# Altium schematic sheet 300_CDH_RS422.SchDoc: RS422 Line Driver
size A; DrawnBy: Tyler Sengia; Engineer: Tyler Sengia; Organization: PSU Student Space Projects Lab; Revision: 1
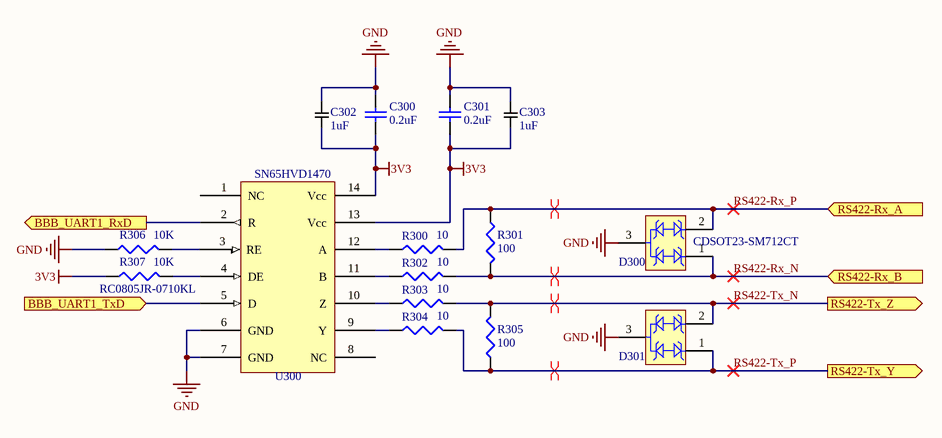
[diagram p0: 300_CDH_RS422.SchDoc]

## Parts
C300  value 0.2uF  [IMPERIAL0805_CAPACITOR]  (hidden comment: 0.2uF Capacitor)
C301  value 0.2uF  [IMPERIAL0805_CAPACITOR]  (hidden comment: 0.2uF Capacitor)
C302  value 1uF  [IMPERIAL0603_Capacitor]  (hidden comment: 1 uF Capacitor)
C303  value 1uF  [IMPERIAL0603_Capacitor]  (hidden comment: 1 uF Capacitor)
D300  Other Names: CDSOT23-SM712CT  [BOUR-SOT23-3_V]  (hidden comment: CDSOT23-SM712)
D301  CDSOT23-SM712  [BOUR-SOT23-3_V]  (value not drawn)
R300  value 10  [Imperial1206_RES]  (hidden comment: 10 Ohm Resistor)
R301  value 100  [Imperial0805_RES]  (hidden comment: 100 Ohm Resistor)
R302  value 10  [Imperial1206_RES]  (hidden comment: 10 Ohm Resistor)
R303  value 10  [Imperial1206_RES]  (hidden comment: 10 Ohm Resistor)
R304  value 10  [Imperial1206_RES]  (hidden comment: 10 Ohm Resistor)
R305  value 100  [Imperial0805_RES]  (hidden comment: 100 Ohm Resistor)
R306  value 10K  [Imperial0805_RES]  (hidden comment: RC0805JR-0710KL)
R307  RC0805JR-0710KL  value 10K  [Imperial0805_RES]
U300  Generic Part Number: SN65HVD1470  [SOIC127P590X175-14M]  (hidden comment: SN65HVD1470D)

## Ports
BBB_UART1_RxD (out), BBB_UART1_TxD (in), RS422-Rx_A (in), RS422-Rx_B (in), RS422-Tx_Y (out), RS422-Tx_Z (out)

## Nets
3V3: C300.1 C301.1 C302.1 C303.1 R307.1 U300.13(Vcc) U300.14(Vcc)
GND: C300.2 C301.2 C302.2 C303.2 D300.3 D301.3 R306.1 U300.6(GND) U300.7(GND)
BBB_UART1_RxD: U300.2(R) ; port BBB_UART1_RxD
BBB_UART1_TxD: U300.5(D) ; port BBB_UART1_TxD
RS422-Rx_N: D300.1 R301.2 R302.2 ; port RS422-Rx_B
RS422-Rx_P: D300.2 R300.2 R301.1 ; port RS422-Rx_A
RS422-Tx_N: D301.2 R303.2 R305.2 ; port RS422-Tx_Z
RS422-Tx_P: D301.1 R304.2 R305.1 ; port RS422-Tx_Y
NetR300_1: R300.1 U300.12(A)
NetR302_1: R302.1 U300.11(B)
NetR303_1: R303.1 U300.10(Z)
NetR304_1: R304.1 U300.9(Y)
NetR306_2: R306.2 U300.3(RE)
NetR307_2: R307.2 U300.4(DE)

Not connected (* = marked no-connect by the designer): U300 1(NC) 8(NC)

## Layout directives
differential pair; rule Impedance Constraint [Min = 90.00    Max = 110.0    ]: RS422-Rx_N, RS422-Rx_P, RS422-Tx_N, RS422-Tx_P

## Library data of the parts
C300 C301 = GCM219R71C204JA37J: Published: 8-Jun-2000; LatestRevisionDate: 29-May-2009; LatestRevisionNote: IPC-7351 Footprint Added.; PackageReference: C1206; Publisher: Altium Limited; PackageDescription: Chip Capacitor; Supplier 1: Mouser; Supplier Part Number 1: 81-GCM219R71C204JA7J
C302 C303 = TMK107BLD105KA-T: Supplier 1: Mouser; Supplier Part Number 1: 963-TMK107BLD105KA-T
D300 = CDSOT23-SM712: TVS Diode, 17 A Ipp, -55 to 150 degC, 3-Pin SOT23, RoHS, Tape and Reel; Manufacturer: Bourns; Catalog Drawings: CDSOT23-SM712Schematic; Current - Peak Pulse (10/1000µs): 17A(8/20µs); Voltage - Breakdown (Min): 7.5V,13.3V; Online Catalog: CDSOT23Series; Power Line Protection: No; Bidirectional Channels: 2; Type: Zener; For Use With: EVAL-CN0313-SDPZ-ND-EVALEMCRS-485CERTIFIED; Kits: PN-DESIGNKIT-22-ND-KITESD/EFTSURGEPROTECTION; Capacitance @ Frequency: 75pF@1MHz; Product Training Modules: ESDProtectionProducts; Voltage - Clamping (Max) @ Ipp: 14V,26V; Voltage - Reverse Standoff (Typ): 7V(Max),12V(Max); Related Products: ADM3485EARZ-REEL7TR-ND-ICTXRXRS-485HS3.3V8SOICADM3485EARZ-REEL7CT-ND-ICTXRXRS-485HS3.3V8SOICADM3485EARZ-REEL7DKR-ND-ICTXRXRS-485HS3.3V8SOICADM3485EARZ-ND-ICTX/RXRS-485HS3.3V8-SOICADM3485EAR-ND-ICTX/RXRS-485HS3.3V8-SOIC296-38503-5-ND-ICTXRXRS4853.3VESD14SOIC296-38501-5-ND-ICRS485TXRX3.3ESD8SOIC296-38522-5-ND-ICTXRXRS4853.3V14SOIC296-38502-5-ND-ICTXRXRS4853.3VESD14SOICADM3485EARZ-REELTR-ND-ICTXRXRS-4853.3V8SOICADM3485EARZ-REELCT-ND-ICTXRXRS-4853.3V8SOICADM3485EARZ-REELDKR-ND-ICTXRXRS-4853.3V8SOIC296-40517-2-ND-ICTXRXRS4853.3V14SOIC296-40517-1-ND-ICTXRXRS4853.3V14SOIC296-40517-6-ND-ICTXRXRS4853.3V14SOIC296-40519-2-ND-ICRS485TXRX3.3ESD8SOIC296-40519-1-ND-ICRS485TXRX3.3ESD8SOIC296-40519-6-ND-ICRS485TXRX3.3ESD8SOIC296-40524-2-ND-ICTXRXRS4853.3VESD8SOIC296-40524-1-ND-ICTXRXRS4853.3VESD8SOIC296-40524-6-ND-ICTXRXRS4853.3VESD8SOIC296-40522-2-ND-ICTXRXRS4853.3VESD14SOIC296-40522-1-ND-ICTXRXRS4853.3VESD14SOIC296-40522-6-ND-ICTXRXRS4853.3VESD14SOIC296-40529-2-ND-ICRS485TXRX3.3ESD8SOIC296-40529-1-ND-ICRS485TXRX3.3ESD8SOIC2; Power - Peak Pulse: 400W; Applications: GeneralPurpose; Supplier Device Package: SOT-23-3; Package / Case: TO-236-3,SC-59,SOT-23-3; Mounting Type: SurfaceMount; Datasheet URL: https://datasheet.ciiva.com/11193/cdsot23-sm712-11193846.pdf; Standard Package: 1; Series: -; Category: CircuitProtection; Unidirectional Channels: -; Package Description: 3-Lead Small Out-Line Transistor, Body 2.9x1.3mm, Pitch 0.95mm; Family: TVS-Diodes; Datasheet Version: Aug-12; Manufacturer URL: http://www.bourns.com/; Operating Temperature: -55degC~150degC(TJ); Packaging: CutTape(CT)
D301 = CDSOT23-SM712: TVS Diode, 17 A Ipp, -55 to 150 degC, 3-Pin SOT23, RoHS, Tape and Reel; Manufacturer: Bourns; Catalog Drawings: CDSOT23-SM712Schematic; Current - Peak Pulse (10/1000µs): 17A(8/20µs); Voltage - Breakdown (Min): 7.5V,13.3V; Online Catalog: CDSOT23Series; Power Line Protection: No; Bidirectional Channels: 2; Type: Zener; For Use With: EVAL-CN0313-SDPZ-ND-EVALEMCRS-485CERTIFIED; Kits: PN-DESIGNKIT-22-ND-KITESD/EFTSURGEPROTECTION; Capacitance @ Frequency: 75pF@1MHz; Product Training Modules: ESDProtectionProducts; Voltage - Clamping (Max) @ Ipp: 14V,26V; Voltage - Reverse Standoff (Typ): 7V(Max),12V(Max); Related Products: ADM3485EARZ-REEL7TR-ND-ICTXRXRS-485HS3.3V8SOICADM3485EARZ-REEL7CT-ND-ICTXRXRS-485HS3.3V8SOICADM3485EARZ-REEL7DKR-ND-ICTXRXRS-485HS3.3V8SOICADM3485EARZ-ND-ICTX/RXRS-485HS3.3V8-SOICADM3485EAR-ND-ICTX/RXRS-485HS3.3V8-SOIC296-38503-5-ND-ICTXRXRS4853.3VESD14SOIC296-38501-5-ND-ICRS485TXRX3.3ESD8SOIC296-38522-5-ND-ICTXRXRS4853.3V14SOIC296-38502-5-ND-ICTXRXRS4853.3VESD14SOICADM3485EARZ-REELTR-ND-ICTXRXRS-4853.3V8SOICADM3485EARZ-REELCT-ND-ICTXRXRS-4853.3V8SOICADM3485EARZ-REELDKR-ND-ICTXRXRS-4853.3V8SOIC296-40517-2-ND-ICTXRXRS4853.3V14SOIC296-40517-1-ND-ICTXRXRS4853.3V14SOIC296-40517-6-ND-ICTXRXRS4853.3V14SOIC296-40519-2-ND-ICRS485TXRX3.3ESD8SOIC296-40519-1-ND-ICRS485TXRX3.3ESD8SOIC296-40519-6-ND-ICRS485TXRX3.3ESD8SOIC296-40524-2-ND-ICTXRXRS4853.3VESD8SOIC296-40524-1-ND-ICTXRXRS4853.3VESD8SOIC296-40524-6-ND-ICTXRXRS4853.3VESD8SOIC296-40522-2-ND-ICTXRXRS4853.3VESD14SOIC296-40522-1-ND-ICTXRXRS4853.3VESD14SOIC296-40522-6-ND-ICTXRXRS4853.3VESD14SOIC296-40529-2-ND-ICRS485TXRX3.3ESD8SOIC296-40529-1-ND-ICRS485TXRX3.3ESD8SOIC2; Other Names: CDSOT23-SM712CT; Power - Peak Pulse: 400W; Applications: GeneralPurpose; Supplier Device Package: SOT-23-3; Package / Case: TO-236-3,SC-59,SOT-23-3; Mounting Type: SurfaceMount; Datasheet URL: https://datasheet.ciiva.com/11193/cdsot23-sm712-11193846.pdf; Standard Package: 1; Series: -; Category: CircuitProtection; Unidirectional Channels: -; Package Description: 3-Lead Small Out-Line Transistor, Body 2.9x1.3mm, Pitch 0.95mm; Family: TVS-Diodes; Datasheet Version: Aug-12; Manufacturer URL: http://www.bourns.com/; Operating Temperature: -55degC~150degC(TJ); Packaging: CutTape(CT)
R300 R302-R304 = SR732BTTE10R0F: 10 Ohm Resistor, RS-422 shockproof resistor; Published: 8-Jun-2000; LatestRevisionDate: 29-May-2009; LatestRevisionNote: IPC-7351 Footprint Added.; PackageReference: J1-0603; Publisher: Altium Limited; PackageDescription: Chip Resistor; Supplier 1: Mouser; Supplier Part Number 1: 660-SR732BTTE10R0F
R301 R305 = SR0805FR-47100RL: 100 Ohm resistor, RS422 Terminating Resistor; Published: 8-Jun-2000; LatestRevisionDate: 29-May-2009; LatestRevisionNote: IPC-7351 Footprint Added.; PackageReference: J1-0603; Publisher: Altium Limited; PackageDescription: Chip Resistor; Supplier 1: Digi-Key; Supplier Part Number 1: YAG5845CT-ND
R306 R307 = RC0805JR-0710KL: 10K resistor, 1/8W, 0805 Imperial; Manufacturer_Name: YAGEO (PHYCOMP); Datasheet Link: http://www.yageo.com/documents/recent/PYu-RC_Group_51_RoHS_L_10.pdf; Height: 0.6mm; Manufacturer_Part_Number: RC0805JR-0710KL
U300 = SN65HVD1470D: RS-422 line driver IC; Supplier 1: Digi-Key; Supplier Part Number 1: 296-40501-1-ND